# EAGLE design USBMiniBPower (EAGLE 6.5.0)
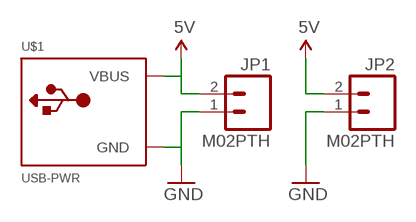
[diagram p0: schematic, sheet 1]

## Parts
JP1  M02PTH  [1X02]
JP2  M02PTH  [1X02]
U$1  USB-PWR  [USB-MINIB-THM-MOLEX-PWRONLY]

## Nets
5V: JP1.2 JP2.2 U$1.VBUS
GND: JP1.1 JP2.1 U$1.GND

## Library data of the parts
JP1 JP2 = SparkFun-Connectors:M02: Standard 2-pin 0.1" header. Use with - straight break away headers ( PRT-00116) - right angle break away headers (PRT-00553) - swiss pins (PRT-00743) - machine pins (PRT-00117) - female headers (PRT-00115) Molex polarized connector foot print use with: PRT-08233 with associated crimp pins and housings. 2.54_SCREWTERM for use with PRT-10571. 3.5mm Screw Terminal footprints for PRT-08084 5mm Screw Terminal footprints for use with PRT-08433
U$1 = adafruit:USB-PWR

## Board
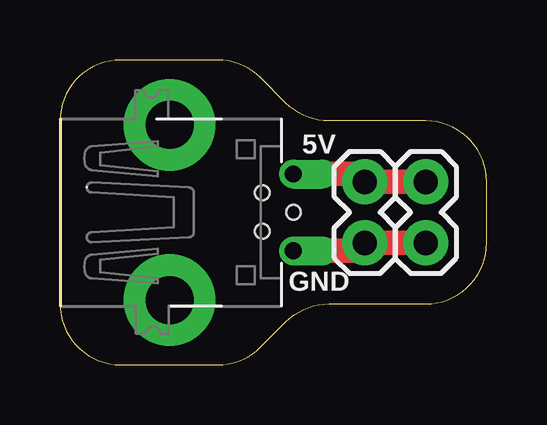
[diagram p1: board, top side]
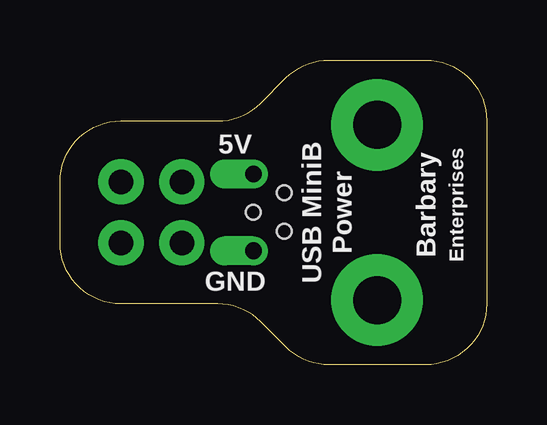
[diagram p2: board, bottom side, seen from below]

Size 17.78 x 12.7 mm. Coordinates in mm from the lower left corner, seen from the top.
Outline: 0,10.16 0,2.54 arc90 2.54,0 6.57,0 arc45 8.36,0.74 9.42,1.8 arc-45 11.21,2.54 15.24,2.54 arc90 17.78,5.08 17.78,7.62 arc90 15.24,10.16 11.21,10.16 arc-45 9.42,10.9 8.36,11.96 arc45 6.57,12.7 2.54,12.7 arc90 0,10.16
Copper layers (1*16): Top 0.035mm / dielectric 1.5mm / Bottom 0.035mm
Design rules "default": minimum track width 10mil, minimum drill 24mil, track to track 8mil, track to pad 8mil, pad to pad 8mil, via to via 8mil, smd to smd 8mil, copper to edge 40mil, drill to drill 8mil, minimum pad ring 10mil, minimum via ring 8mil, stop-mask expansion 4mil, vias tented up to drill 0mil, thermal gap 10mil

### Footprints (pad centres in the part's own frame; a part is rotated, then mirrored left to right if it is on the bottom)
1X02 = drill 1.016 pad 1.88: 1 0,0; 2 2.54,0
USB-MINIB-THM-MOLEX-PWRONLY = drill 0.7 offset: GND 1.6,4.64; VBUS -1.6,4.64 | drill 2 pad 3.81: GND1 -3.65,-0.51; GND4 3.65,-0.51 | hole 0.6: 0,4.648; 0.787,3.353; -0.813,3.353

### Placement (x,y rotation side)
JP1  15.24,5.08 90 top
JP2  12.7,5.08 90 top
U$1  5.08,6.35 270 top

### Tracks (layer width: path | path; a pad name or v marks a point on that pad's centre or on a via)
5V
  Top 1.016: U$1.VBUS 12.37,7.95 JP2.2 JP1.2
GND
  Top 1.016: U$1.GND 12.37,4.75 JP2.1 JP1.1

### Text on the board
tPlace: 5V | GND
bPlace: 5V | Enterprises | Barbary | Power | USB MiniB | GND